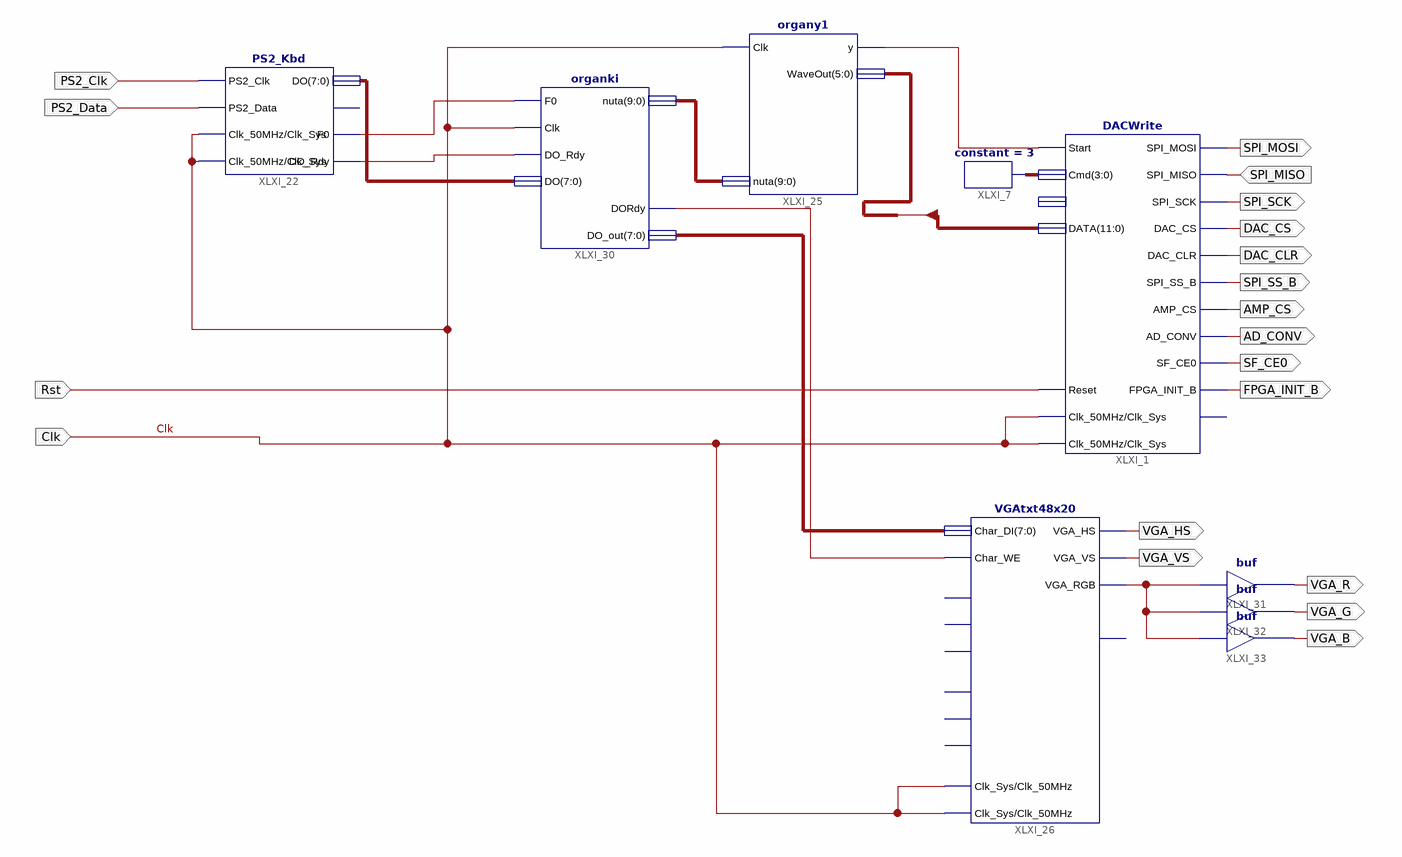
[diagram p0: schematic sheet 1]
// Xilinx ISE schematic harmonica.sch (spartan3e) as structural Verilog: 9 symbols, 19 ports
module harmonica (
  input  Clk,
  input  SPI_MISO,
  input  Rst,
  input  PS2_Clk,
  input  PS2_Data,
  output SPI_MOSI,
  output SPI_SCK,
  output DAC_CS,
  output DAC_CLR,
  output SPI_SS_B,
  output AMP_CS,
  output AD_CONV,
  output SF_CE0,
  output FPGA_INIT_B,
  output VGA_HS,
  output VGA_VS,
  output VGA_R,
  output VGA_G,
  output VGA_B
);

  wire XLXN_109, XLXN_111, XLXN_112, XLXN_117, XLXN_124;
  wire [3:0] XLXN_19;
  wire [7:0] XLXN_21, XLXN_128;
  wire [9:0] XLXN_107;
  wire [11:0] DATA;

  DACWrite XLXI_1 (
    .Reset(Rst), .Start(XLXN_109), .SPI_MISO(SPI_MISO), .Cmd(XLXN_19), .DATA(DATA), .DAC_CLR(DAC_CLR),
    .DAC_CS(DAC_CS), .SPI_MOSI(SPI_MOSI), .SPI_SCK(SPI_SCK), .SPI_SS_B(SPI_SS_B), .AMP_CS(AMP_CS),
    .AD_CONV(AD_CONV), .SF_CE0(SF_CE0), .FPGA_INIT_B(FPGA_INIT_B), .Clk_50MHz(Clk), .Clk_Sys(Clk));  // open: Addr, Busy
  constant #(.CValue("3")) XLXI_7 (.O(XLXN_19));
  PS2_Kbd XLXI_22 (
    .PS2_Clk(PS2_Clk), .PS2_Data(PS2_Data), .Clk_50MHz(Clk), .F0(XLXN_111), .DO_Rdy(XLXN_112), .DO(XLXN_21),
    .Clk_Sys(Clk));  // open: E0
  organy1 XLXI_25 (.Clk(Clk), .y(XLXN_109), .WaveOut(DATA[11:6]), .nuta(XLXN_107));
  VGAtxt48x20 XLXI_26 (
    .Char_DI(XLXN_128), .Clk_Sys(Clk), .Clk_50MHz(Clk), .VGA_HS(VGA_HS), .VGA_VS(VGA_VS), .VGA_RGB(XLXN_117),
    .Char_WE(XLXN_124));  // open: Home, NewLine, Goto00, CursorOn, ScrollEn, ScrollClear, Busy
  organki XLXI_30 (
    .F0(XLXN_111), .Clk(Clk), .DO_Rdy(XLXN_112), .DO(XLXN_21), .nuta(XLXN_107), .DORdy(XLXN_124),
    .DO_out(XLXN_128));
  buf XLXI_31 (VGA_R, XLXN_117);
  buf XLXI_32 (VGA_G, XLXN_117);
  buf XLXI_33 (VGA_B, XLXN_117);
endmodule
